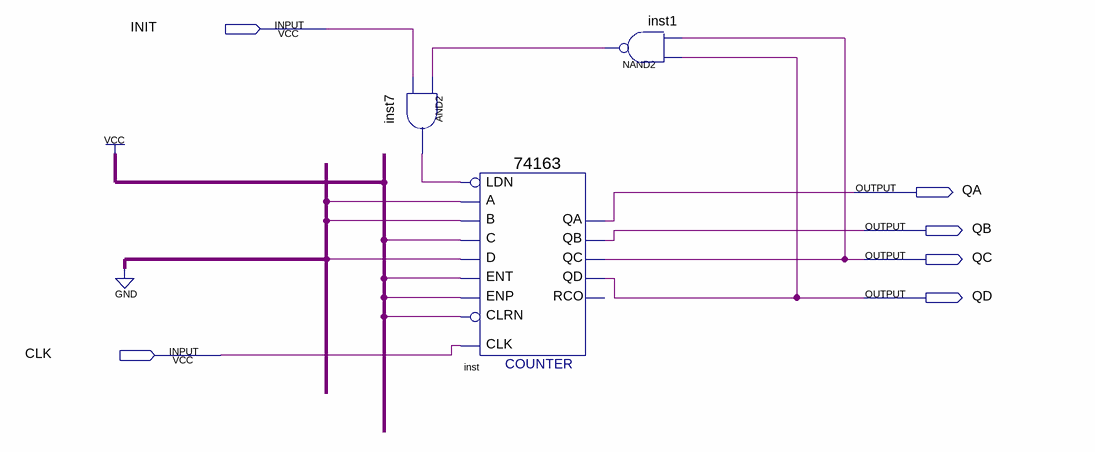
[diagram p0: schematic sheet]
// Quartus schematic SpecialCount4.bdf as structural Verilog: 3 symbols, 6 pins
module SpecialCount4 (
  input  INIT,
  input  CLK,
  output QA,
  output QB,
  output QC,
  output QD
);

  wire inst1_out, inst7_out;

  and inst7 (inst7_out, inst1_out, INIT);
  \74163  inst (
    .C(1'b1), .B(1'b0), .A(1'b0), .ENT(1'b1), .D(1'b0), .CLRN(1'b1), .CLK(CLK), .ENP(1'b1), .LDN(inst7_out),
    .QA(QA), .QB(QB), .QC(QC), .QD(QD));  // open: RCO
  nand inst1 (inst1_out, QD, QC);
endmodule
